# Altium schematic sheet schema.SchDoc
size A4
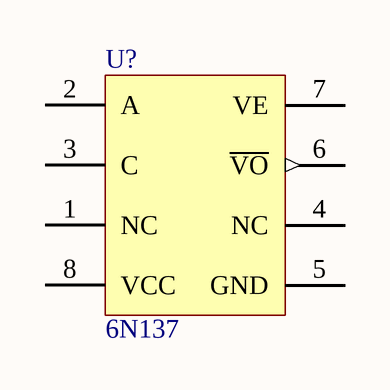
[diagram p0: schema.SchDoc]

## Parts
U?  6N137  [VISH-DIP-8_A]

## Nets

Not connected (* = marked no-connect by the designer): U? 1(NC) 2(A) 3(C) 4(NC) 5(GND) 6(~{VO}) 7(VE) 8(VCC)

## Library data of the parts
U? = CMP-2000-05669-1: High Speed Optocoupler, Single and Dual, 10 MBd, 5 V, -40 to 100 degC, 8-Pin DIP, RoHS, Tube; Manufacturer: Vishay; No. of Channels: 1Channel; Isolation Voltage: 5.3kV; Data Rate: 10Mbaud; SVHC: ToBeAdvised; No. of Pins: 8Pins; Package Description: 8-Pin Double In-line Package, Body 10.16 x 6.7 mm, Pitch 2.54 mm; Manufacturer URL: http://www.vishay.com/; Product Range: -; Optocoupler Case Style: DIP; Mounting Technology: ThroughHole; Packaging: Each; Package Reference: DIP-8; Datasheet Version: Rev. 1.9, 03/2015; Datasheet URL: http://www.vishay.com/docs/84732/6n137.pdf